# Altium project EVXXXX_02-01243_Drone_ESC_Ref_Design.PrjPCB (part 4 of 4)
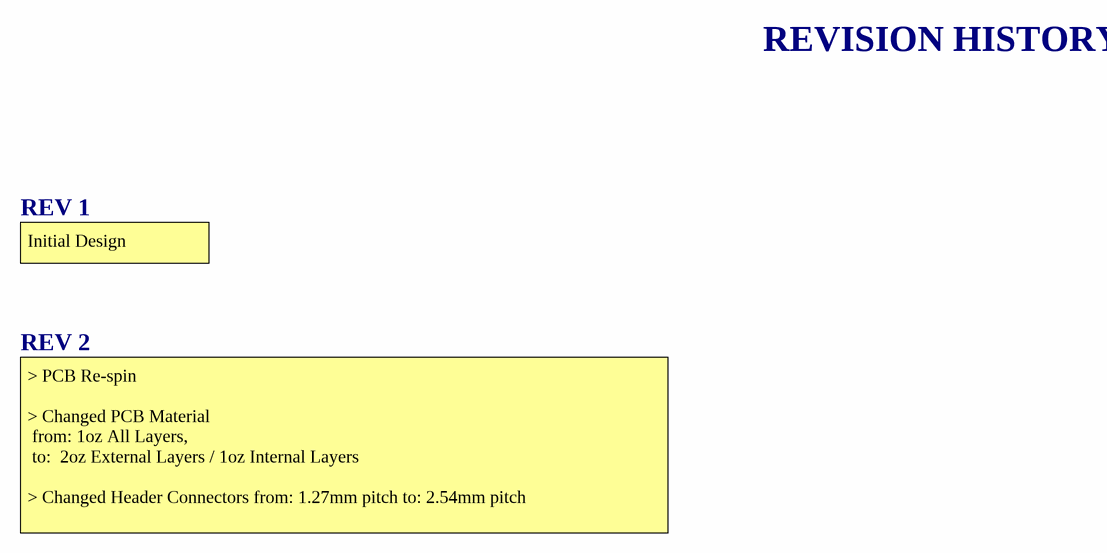
[diagram p5: Sheet5_RevHistory.SchDoc]

## Nets that join several sheets
GND: Sheet1_dsPIC33CDV+OpAmp (17 pins), Sheet2_Inverter_GateDriver (11 pins), Sheet3_SenseCkts_Programming_Interface (22 pins), Sheet4_CAN_Interface (10 pins)
HVDD: Sheet2_Inverter_GateDriver (C50.2 U9.7), Sheet3_SenseCkts_Programming_Interface (R9.2)
VDC: Sheet2_Inverter_GateDriver (6 pins), Sheet3_SenseCkts_Programming_Interface (6 pins)
VDD: Sheet1_dsPIC33CDV+OpAmp (19 pins), Sheet3_SenseCkts_Programming_Interface (7 pins)
VREG: Sheet2_Inverter_GateDriver (C49.1 U9.6), Sheet3_SenseCkts_Programming_Interface (R54.1)
AD_PWM_IN1: Sheet1_dsPIC33CDV+OpAmp (U9.30), Sheet3_SenseCkts_Programming_Interface (R11.2)
AD_PWM_IN2: Sheet1_dsPIC33CDV+OpAmp (U9.27), Sheet3_SenseCkts_Programming_Interface (R12.2)
dsPIC_DEBUG_RX: Sheet1_dsPIC33CDV+OpAmp (U9.32), Sheet3_SenseCkts_Programming_Interface (J3.2)
dsPIC_DEBUG_TX: Sheet1_dsPIC33CDV+OpAmp (U9.31), Sheet3_SenseCkts_Programming_Interface (J3.1)
LED: Sheet1_dsPIC33CDV+OpAmp (U9.29), Sheet3_SenseCkts_Programming_Interface (R187.1 TP17.1)
PHASE_A: Sheet2_Inverter_GateDriver (9 pins), Sheet3_SenseCkts_Programming_Interface (R110.1)
PHASE_B: Sheet2_Inverter_GateDriver (9 pins), Sheet3_SenseCkts_Programming_Interface (R112.1)
PHASE_C: Sheet2_Inverter_GateDriver (9 pins), Sheet3_SenseCkts_Programming_Interface (R111.1)
SHUNT_IA_N: Sheet1_dsPIC33CDV+OpAmp (R67.1), Sheet2_Inverter_GateDriver (NT3.1)
SHUNT_IA_P: Sheet1_dsPIC33CDV+OpAmp (R74.1), Sheet2_Inverter_GateDriver (NT2.1)
SHUNT_IB_N: Sheet1_dsPIC33CDV+OpAmp (R83.1), Sheet2_Inverter_GateDriver (NT5.1)
SHUNT_IB_P: Sheet1_dsPIC33CDV+OpAmp (R91.1), Sheet2_Inverter_GateDriver (NT1.1)
SHUNT_IBUS_N: Sheet1_dsPIC33CDV+OpAmp (R21.1), Sheet2_Inverter_GateDriver (NT6.1)
SHUNT_IBUS_P: Sheet1_dsPIC33CDV+OpAmp (R58.1), Sheet2_Inverter_GateDriver (NT4.1)
UART_PWM: Sheet1_dsPIC33CDV+OpAmp (U9.21), Sheet3_SenseCkts_Programming_Interface (R1.2)
V_BUS: Sheet1_dsPIC33CDV+OpAmp (U9.13), Sheet3_SenseCkts_Programming_Interface (R133.2)
VA: Sheet1_dsPIC33CDV+OpAmp (U9.47), Sheet3_SenseCkts_Programming_Interface (R114.2)
VB: Sheet1_dsPIC33CDV+OpAmp (U9.46), Sheet3_SenseCkts_Programming_Interface (R118.2)
VC: Sheet1_dsPIC33CDV+OpAmp (U9.45), Sheet3_SenseCkts_Programming_Interface (R115.2)

## Assembly variants
Standard: all parts fitted